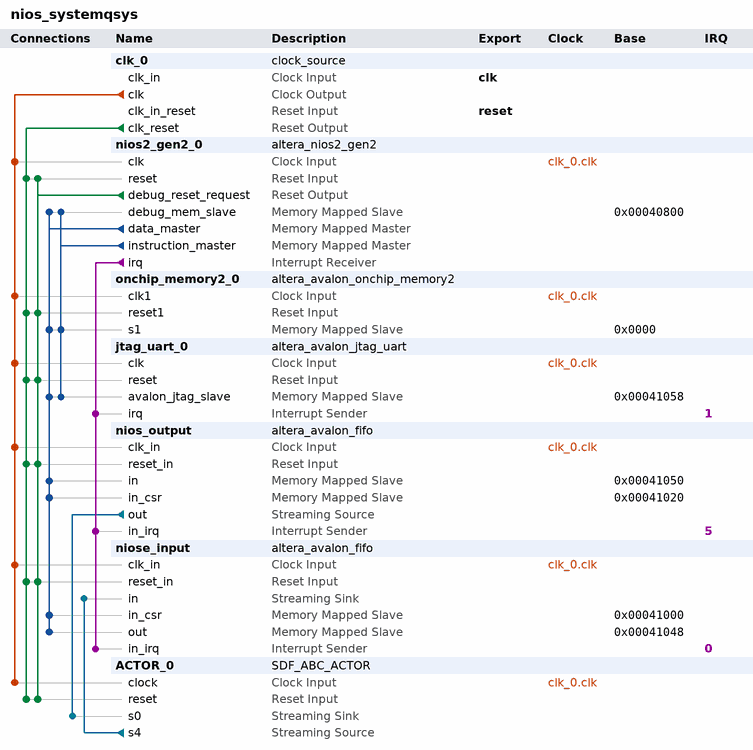
[diagram p0: system contents]
# Platform Designer (Qsys) system nios_systemqsys, Cyclone V 5CSEBA6U23I7
# Parameters at their usual value, and those the tool derives, are not listed.
package require -exact qsys 22.1
create_system nios_systemqsys
set_project_property DEVICE_FAMILY {Cyclone V}
set_project_property DEVICE 5CSEBA6U23I7

add_instance clk_0 clock_source 22.1
set_instance_parameter_value clk_0 clockFrequency 50000000

add_instance nios2_gen2_0 altera_nios2_gen2 22.1
set_instance_parameter_value nios2_gen2_0 dcache_size 2048
set_instance_parameter_value nios2_gen2_0 exceptionSlave onchip_memory2_0.s1
set_instance_parameter_value nios2_gen2_0 icache_size 4096
set_instance_parameter_value nios2_gen2_0 impl Tiny
set_instance_parameter_value nios2_gen2_0 resetSlave onchip_memory2_0.s1

add_instance onchip_memory2_0 altera_avalon_onchip_memory2 22.1
set_instance_parameter_value onchip_memory2_0 dataWidth 32
set_instance_parameter_value onchip_memory2_0 dualPort false
set_instance_parameter_value onchip_memory2_0 initMemContent true
set_instance_parameter_value onchip_memory2_0 initializationFileName onchip_mem.hex
set_instance_parameter_value onchip_memory2_0 memorySize 153600

add_instance jtag_uart_0 altera_avalon_jtag_uart 22.1
set_instance_parameter_value jtag_uart_0 readBufferDepth 1024
set_instance_parameter_value jtag_uart_0 simInteractiveOptions NO_INTERACTIVE_WINDOWS
set_instance_parameter_value jtag_uart_0 writeBufferDepth 1024

add_instance nios_output altera_avalon_fifo 22.1
set_instance_parameter_value nios_output bitsPerSymbol 32
set_instance_parameter_value nios_output channelWidth 8
set_instance_parameter_value nios_output errorWidth 8
set_instance_parameter_value nios_output fifoDepth 8
set_instance_parameter_value nios_output fifoInputInterfaceOptions AVALONMM_WRITE
set_instance_parameter_value nios_output fifoOutputInterfaceOptions AVALONST_SOURCE
set_instance_parameter_value nios_output singleClockMode true
set_instance_parameter_value nios_output symbolsPerBeat 1
set_instance_parameter_value nios_output useIRQ true
set_instance_parameter_value nios_output usePacket false
set_instance_parameter_value nios_output useReadControl false

add_instance niose_input altera_avalon_fifo 22.1
set_instance_parameter_value niose_input bitsPerSymbol 32
set_instance_parameter_value niose_input channelWidth 8
set_instance_parameter_value niose_input errorWidth 8
set_instance_parameter_value niose_input fifoDepth 8
set_instance_parameter_value niose_input fifoInputInterfaceOptions AVALONST_SINK
set_instance_parameter_value niose_input fifoOutputInterfaceOptions AVALONMM_READ
set_instance_parameter_value niose_input singleClockMode true
set_instance_parameter_value niose_input symbolsPerBeat 1
set_instance_parameter_value niose_input useIRQ true
set_instance_parameter_value niose_input usePacket false
set_instance_parameter_value niose_input useReadControl false

add_instance ACTOR_0 SDF_ABC_ACTOR 1.0

# connections
add_connection clk_0.clk ACTOR_0.clock clock
add_connection clk_0.clk jtag_uart_0.clk clock
add_connection clk_0.clk nios2_gen2_0.clk clock
add_connection clk_0.clk nios_output.clk_in clock
add_connection clk_0.clk niose_input.clk_in clock
add_connection clk_0.clk onchip_memory2_0.clk1 clock
add_connection clk_0.clk_reset ACTOR_0.reset reset
add_connection clk_0.clk_reset jtag_uart_0.reset reset
add_connection clk_0.clk_reset nios2_gen2_0.reset reset
add_connection clk_0.clk_reset nios_output.reset_in reset
add_connection clk_0.clk_reset niose_input.reset_in reset
add_connection clk_0.clk_reset onchip_memory2_0.reset1 reset
add_connection nios2_gen2_0.debug_reset_request ACTOR_0.reset reset
add_connection nios2_gen2_0.debug_reset_request jtag_uart_0.reset reset
add_connection nios2_gen2_0.debug_reset_request nios2_gen2_0.reset reset
add_connection nios2_gen2_0.debug_reset_request nios_output.reset_in reset
add_connection nios2_gen2_0.debug_reset_request niose_input.reset_in reset
add_connection nios2_gen2_0.debug_reset_request onchip_memory2_0.reset1 reset
add_connection nios2_gen2_0.data_master jtag_uart_0.avalon_jtag_slave avalon
set_connection_parameter_value nios2_gen2_0.data_master/jtag_uart_0.avalon_jtag_slave baseAddress 0x00041058
add_connection nios2_gen2_0.data_master nios2_gen2_0.debug_mem_slave avalon
set_connection_parameter_value nios2_gen2_0.data_master/nios2_gen2_0.debug_mem_slave baseAddress 0x00040800
add_connection nios2_gen2_0.data_master nios_output.in avalon
set_connection_parameter_value nios2_gen2_0.data_master/nios_output.in baseAddress 0x00041050
add_connection nios2_gen2_0.data_master nios_output.in_csr avalon
set_connection_parameter_value nios2_gen2_0.data_master/nios_output.in_csr baseAddress 0x00041020
add_connection nios2_gen2_0.data_master niose_input.in_csr avalon
set_connection_parameter_value nios2_gen2_0.data_master/niose_input.in_csr baseAddress 0x00041000
add_connection nios2_gen2_0.data_master niose_input.out avalon
set_connection_parameter_value nios2_gen2_0.data_master/niose_input.out baseAddress 0x00041048
add_connection nios2_gen2_0.data_master onchip_memory2_0.s1 avalon
set_connection_parameter_value nios2_gen2_0.data_master/onchip_memory2_0.s1 baseAddress 0x0000
add_connection nios2_gen2_0.instruction_master jtag_uart_0.avalon_jtag_slave avalon
set_connection_parameter_value nios2_gen2_0.instruction_master/jtag_uart_0.avalon_jtag_slave baseAddress 0x00041058
add_connection nios2_gen2_0.instruction_master nios2_gen2_0.debug_mem_slave avalon
set_connection_parameter_value nios2_gen2_0.instruction_master/nios2_gen2_0.debug_mem_slave baseAddress 0x00040800
add_connection nios2_gen2_0.instruction_master onchip_memory2_0.s1 avalon
set_connection_parameter_value nios2_gen2_0.instruction_master/onchip_memory2_0.s1 baseAddress 0x0000
add_connection ACTOR_0.s4 niose_input.in avalon_streaming
add_connection nios_output.out ACTOR_0.s0 avalon_streaming
add_connection nios2_gen2_0.irq jtag_uart_0.irq interrupt
set_connection_parameter_value nios2_gen2_0.irq/jtag_uart_0.irq irqNumber 1
add_connection nios2_gen2_0.irq nios_output.in_irq interrupt
set_connection_parameter_value nios2_gen2_0.irq/nios_output.in_irq irqNumber 5
add_connection nios2_gen2_0.irq niose_input.in_irq interrupt
set_connection_parameter_value nios2_gen2_0.irq/niose_input.in_irq irqNumber 0

# exported interfaces
add_interface clk clock sink
set_interface_property clk EXPORT_OF clk_0.clk_in
add_interface reset reset sink
set_interface_property reset EXPORT_OF clk_0.clk_in_reset

set_interconnect_requirement {$system} qsys_mm.clockCrossingAdapter HANDSHAKE
set_interconnect_requirement {$system} qsys_mm.enableEccProtection FALSE
set_interconnect_requirement {$system} qsys_mm.insertDefaultSlave FALSE
set_interconnect_requirement {$system} qsys_mm.maxAdditionalLatency 1

save_system nios_systemqsys.qsys
